# Altium project AX-12_PSU.PrjPcb
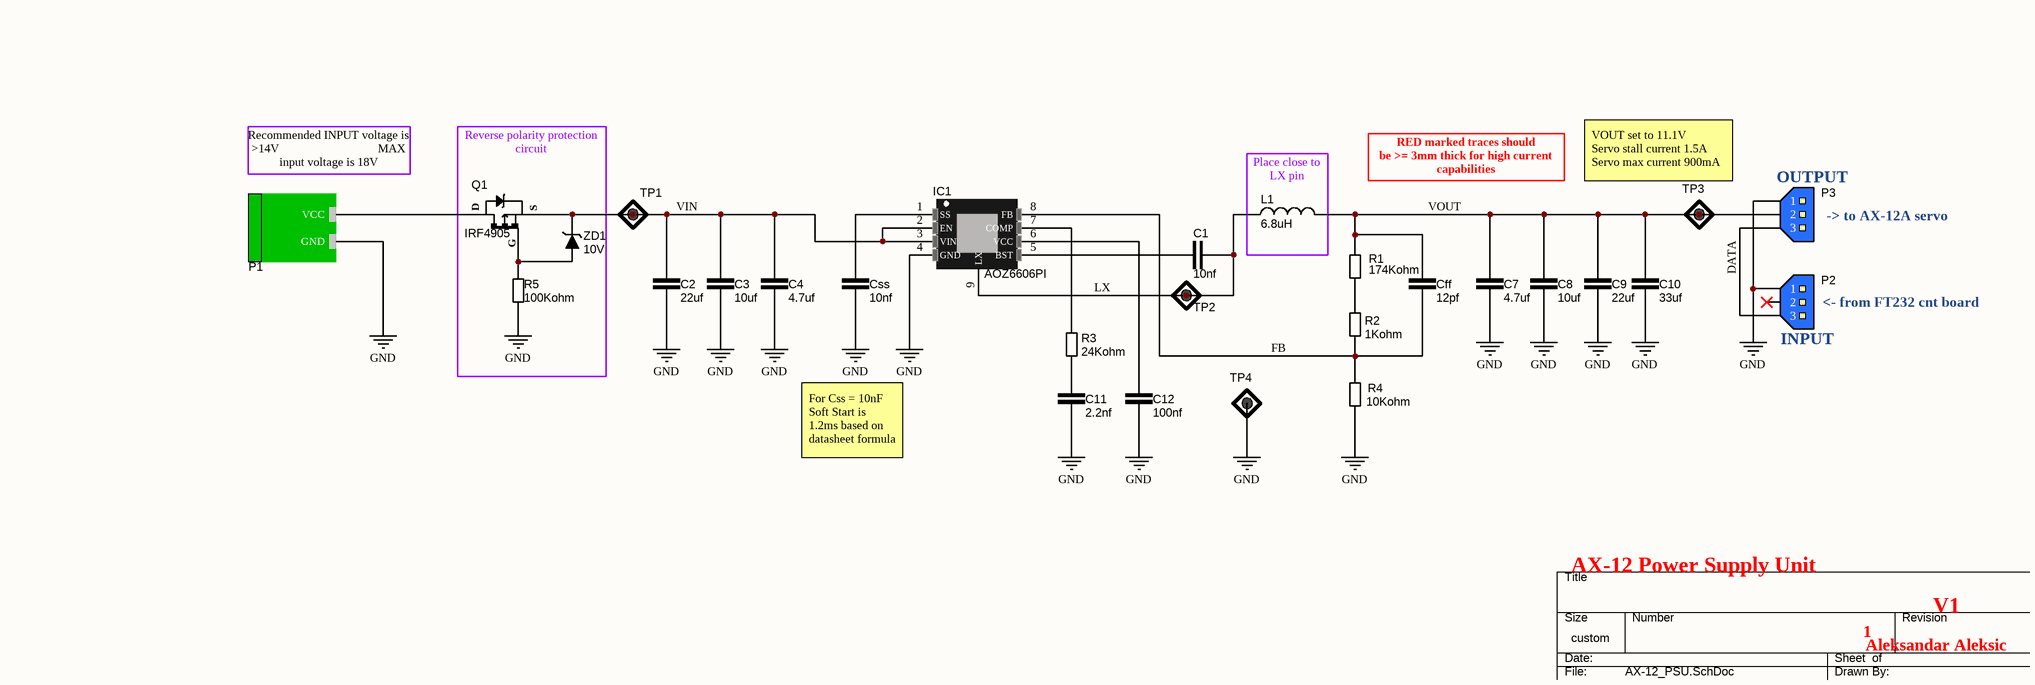
[diagram p0: AX-12_PSU.SchDoc]
1 sheet, 28 parts. Net scope: global (net labels, ports and power ports of the same name join across sheets).
Board file: AX-12_PSU.PcbDoc

## Sheet AX-12_PSU.SchDoc: AX-12 Power Supply Unit
size 381 x 127 mm; DrawnBy: Aleksandar Aleksic; Organization: MEMRISTOR; Revision: V1; SheetNumber: 1; SheetTotal: 1; SPICEModelCacheXSSZKXUI: <root> / <DocumentId>XSSZKXUI</DocumentId> / </root>

### Parts
C1  10nf  [CAP_0603]
C2  22uf  [CAP_0805]
C3  10uf  [CAP_0805]
C4  4.7uf  [CAP_0805]
C7  4.7uf  [CAP_0805]
C8  10uf  [CAP_0805]
C9  22uf  [CAP_0805]
C10  33uf  [CAP_1206]
C11  2.2nf  [CAP_0603]
C12  100nf  [CAP_0603]
Cff  12pf  [CAP_0603]
Css  10nf  [CAP_0603]
IC1  AOZ6606PI  [SOP127P600X170_HS-9N]
L1  6.8uH  [INDM108103X40N]
P1  2EDGRC-5.08-02P-14-00A(H)  [PWR_Con]  (value not drawn)
P2  TE CONNECTIVITY_3PIN_MALE  [TE CONNECTIVITY_3PIN_MALE]  (value not drawn)
P3  TE CONNECTIVITY_3PIN_MALE  [TE CONNECTIVITY_3PIN_MALE]  (value not drawn)
Q1  IRF4905  [DPAK254P1524X483-3N]
R1  174Kohm  [RES_0603]
R2  1Kohm  [RES_0603]
R3  24Kohm  [RES_0603]
R4  10Kohm  [RES_0603]
R5  100Kohm  [RES_0603]
TP1  TestPoint  [TestPoint]  (value not drawn)
TP2  TestPoint  [TestPoint]  (value not drawn)
TP3  TestPoint  [TestPoint]  (value not drawn)
TP4  TestPoint  [TestPoint]  (value not drawn)
ZD1  10V  [DIO_SMA]

### Nets
GND: C2.1 C3.1 C4.1 C7.1 C8.1 C9.1 C10.1 C11.1 C12.1 Css.1 IC1.4(GND) P1.1(GND) P2.1 P3.1 R4.1 R5.1 TP4.1
DATA: P2.3 P3.3
FB: Cff.1 IC1.8(FB) R2.1 R4.2
LX: C1.2 IC1.9(LX) L1.1 TP2.1
VIN: C2.2 C3.2 C4.2 IC1.2(EN) IC1.3(VIN) Q1.3 TP1.1 ZD1.1(Cathode)
VOUT: C7.2 C8.2 C9.2 C10.2 Cff.2 L1.2 P3.2 R1.2 TP3.1
NetC1_1: C1.1 IC1.5(BST)
NetC11_2: C11.2 R3.1
NetC12_2: C12.2 IC1.6(VCC)
NetCss_2: Css.2 IC1.1(SS)
NetIC1_7: IC1.7(COMP) R3.2
NetP1_2: P1.2(VCC) Q1.4
NetQ1_1: Q1.1(G) R5.2 ZD1.2(Anode)
NetR1_1: R1.1 R2.2

Not connected (* = marked no-connect by the designer): P2 2*

### Notes on the sheet
- (near P1) Recommended INPUT voltage is >14V                                 MAX input voltage is 18V
- RED marked traces should                       be >= 3mm thick for high current capabilities
- VOUT set to 11.1V           Servo stall current 1.5A                   Servo max current 900mA
- (near P3) OUTPUT
- (near P3) -> to AX-12A servo
- (near L1) Place close to LX pin
- (near P2) INPUT
- (near P2) <- from FT232 cnt board
- Reverse polarity protection circuit
- For Css = 10nF Soft Start is 1.2ms based on datasheet formula
- DWG. NO.
- REV.
- SHT.
- THIS DOCUMENT AND THE DATA DISCLOSED HEREIN OR HEREWITH IS THE PROPERTY OF ALTIUM LIMITED AND MAY BE FREELY DISTRIBUTED IN WHOLE. NO RIGHTS ARE RESERVED OR EXPRESS OR IMPLIED WARANTEE GIVEN.
- REVISION
- DESCRIPTION
- DATE
- APPROVED
- ENG:
- APPROVALS
- PROJECT
- DSN:
- CHK:
- REFERENCE DOCUMENTS
- PROJECT REVISION:
- TITLE
- DOCUMENT REVISION:
- DESIGN ITEM:
- BOM:
- FAB DWG:
- PCB DWG:
- ASSY DWG:
- SCALE:
- SIZE
- B
- CAGE CODE
- FILE NAME
- DWG NO.
- SHEET
- OF
- REV
- (in symbol IRF4905) D; S

### Library data of the parts
C1 Css = 0000005: CAP CER 10nF 0603 25V X7R; capaticanse: 10nf; ComponentLink1Description: digikey; ComponentLink1URL: https://www.digikey.com/en/products/detail/kyocera-avx/06033C103MAT2A/1599370
C2 C9 = 0000001: CAP CER 22uF 0805 25V X5R; capaticanse: 22uf; ComponentLink1Description: digikey; ComponentLink1URL: https://www.digikey.com/en/products/detail/tdk-corporation/C2012X5R1E226M125AC/3661564
C3 C8 = 0000002: CAP CER 10uF 0805 25V X5R; capaticanse: 10uf; ComponentLink1Description: digikey; ComponentLink1URL: https://www.digikey.com/en/products/detail/tdk-corporation/C2012X5R1E106K125AB/2443462
C4 C7 = 0000003: CAP CER 4.7uF 0805 25V X5R; capaticanse: 4.7uf; ComponentLink1Description: digikey; ComponentLink1URL: https://www.digikey.com/en/products/detail/kemet/C0805C475K3PAC7800/1950665
C10 = 0000004: CAP CER 33uF 1206 25V X5R; capaticanse: 33uf; ComponentLink1Description: digikey; ComponentLink1URL: https://www.digikey.com/en/products/detail/tdk-corporation/C3216X5R1E336M160AC/2792259
C11 = 0000006: CAP CER 2.2nF 0603 25V X7R; capaticanse: 2.2nf; ComponentLink1Description: digikey; ComponentLink1URL: https://www.digikey.com/en/products/detail/yageo/CC0603KRX7R8BB222/2345066
C12 = 0000007: CAP CER 100nF 0603 25V X7R; capaticanse: 100nf; ComponentLink1Description: digikey; ComponentLink1URL: https://www.digikey.com/en/products/detail/kyocera-avx/06033C104K4T2A/8019250
Cff = 0000008: CAP CER 12pF 0603 25V X7R; capaticanse: 12pf; ComponentLink1Description: digikey; ComponentLink1URL: https://www.digikey.com/en/products/detail/kemet/C0603C120J3GACAUTO/11675595
L1 = L000002: IND 6.8uH 8A 23.3mOHM 13.5A ISAT; inductanse: 6.8uH; ComponentLink1Description: digikey; ComponentLink1URL: https://www.digikey.com/en/products/detail/vishay-dale/IHLP4040DZER6R8M01/1220696
P1 = 00000002: TERM BLOCK HDR 2POS 90DEG 5.08MM; Suplier: TME; Manufacturer Part Number: 2EDGRC-5.08-02P-14-00A(H); Suplier Product Link: https://www.tme.eu/en/details/2edgrc5.08-2p14/pluggable-terminal-blocks/degson-electronics/2edgrc-508-02p-14-00ah/; Price: 0.1304
P2 P3 = TE CONNECTIVITY_3PIN_MALE: BLUE_3PIN_CONECTOR; Manufacturer: TE CONNECTIVITY / AMP; Manufacturer Part Number 1: 281695-3; Order Code 1: 1205983; Price 1: £0.403; Supplier 1: uk.farnell.com
Q1 = IRF4905: Manufacturer: International Rectifier; Manufacturer Part Number: IRF1404ZSPBF; Continuous Drain Current (ID): 75A; Current Rating: 49A; Drain to Source Breakdown Voltage: 40V; Drain to Source Resistance: 4mR; Drain-source On Resistance-Max: 3.7MR; Dual Supply Voltage: 55V; Element Configuration: Single; Fall Time: 58ns; Gate to Source Voltage (Vgs): 20V; Input Capacitance: 4.34nF; Max Power Dissipation: 200W; Nominal Vgs: 4V; Number of Elements: 1; Polarity: N-CHANNEL; Power Dissipation: 220W; Recovery Time: 42ns; Rise Time: 110ns; Turn-Off Delay Time: 36ns; Turn-On Delay Time: 18ns; Case/Package: D2PAK; Category: MOSFETs; Drain to Source Voltage (Vdss): 40V; Height: 4.83mm; Lead Free: Lead Free; Length: 10.67mm; Max Operating Temperature: 175°C; Min Operating Temperature: -55°C; Mount: Surface Mount; Number of Pins: 3; Package Quantity: 50; Packaging: Rail/Tube; Radiation Hardening: No; Rds On Max: 3.7mR; REACH SVHC: No SVHC; RoHS Compliant: Yes; Series: HEXFET®; Termination: SMD/SMT; Voltage Rating (DC): 55V; Width: 9.65mm; On-State Resistance: 3.7MR; Threshold Voltage: 4V
R1 = R000003: RES 174K OHM 1% 1/10W 0603; resistance: 174Kohm; ComponentLink1Description: digikey; ComponentLink1URL: https://www.digikey.com/en/products/detail/stackpole-electronics-inc/RMCF0603FT174K/1761066
R2 = R000004: RES 1K OHM 1% 1/10W 0603; resistance: 1Kohm; ComponentLink1Description: digikey; ComponentLink1URL: https://www.digikey.com/en/products/detail/vishay-beyschlag-draloric-bc-components/MCT06030C1001FP500/2607821
R3 = R000005: RES 24K OHM 1% 1/10W 0603; resistance: 24Kohm; ComponentLink1Description: digikey; ComponentLink1URL: https://www.digikey.com/en/products/detail/stackpole-electronics-inc/RMCF0603FG24K0/1713826
R4 = R000001: RES 10K OHM 1% 1/10W 0603; resistance: 10Kohm; ComponentLink1Description: digikey; ComponentLink1URL: https://www.digikey.com/en/products/detail/vishay-beyschlag-draloric-bc-components/MCT06030C1002FP500/1850440
R5 = R000006: RES 100K OHM 1% 1/10W 0603; resistance: 100Kohm; ComponentLink1Description: digikey; ComponentLink1URL: https://www.digikey.com/en/products/detail/stackpole-electronics-inc/RMCF0603FG100K/1713543
TP1-TP4 = TP001
ZD1 = 1SMA5931-AU_R1: Zener Diode 10 V 5 W ±5% Surface Mount SMC (DO-214AB); Value: 10V; ComponentLink1Description: digikey; ComponentLink1URL: https://www.digikey.com/en/products/detail/panjit-international-inc/1SMC5347-AU-R1-000A1/15799564
IC1 = AOZ6606PI: partName: AOZ6606PI